# Altium schematic sheet BOOSTXL-AUDIO_Main.SchDoc
size 431 x 279 mm; Date: Not shown in title block; ApprovedBy: Not shown in title block; CheckedBy: Not shown in title block; Author: Not shown in title block; CompanyName: Not shown in title block; Engineer: Not shown in title block; Organization: Not shown in title block; Address1: Not shown in title block; Address2: Not shown in title block; Address3: Not shown in title block; Address4: Not shown in title block; DocumentNumber: 1; Revision: Use project parameter SCH_Rev; SheetNumber: 1; SheetTotal: 2; PageSetup: Record=PageOptions|CenterHorizontal=True|CenterVertical=True|PrintScale=0.62|XCorrection=1.00|YCorrection=1.00|PrintKind=0|BorderSize=5000000|LeftOffset=0|BottomOffset=0|Orientation=2|PaperLength=1000|PaperWidth=1000|Scale=100|PaperSource=15|PrintQuality=600|MediaType=1|DitherType=10|PrintScaleMode=1|PaperKind=Letter; CurrentTime: Not shown in title block; CurrentDate: Not shown in title block; Time: Not shown in title block; DocumentFullPathAndName: Not shown in title block; DocumentName: Not shown in title block; ModifiedDate: Not shown in title block; ImagePath: Not shown in title block
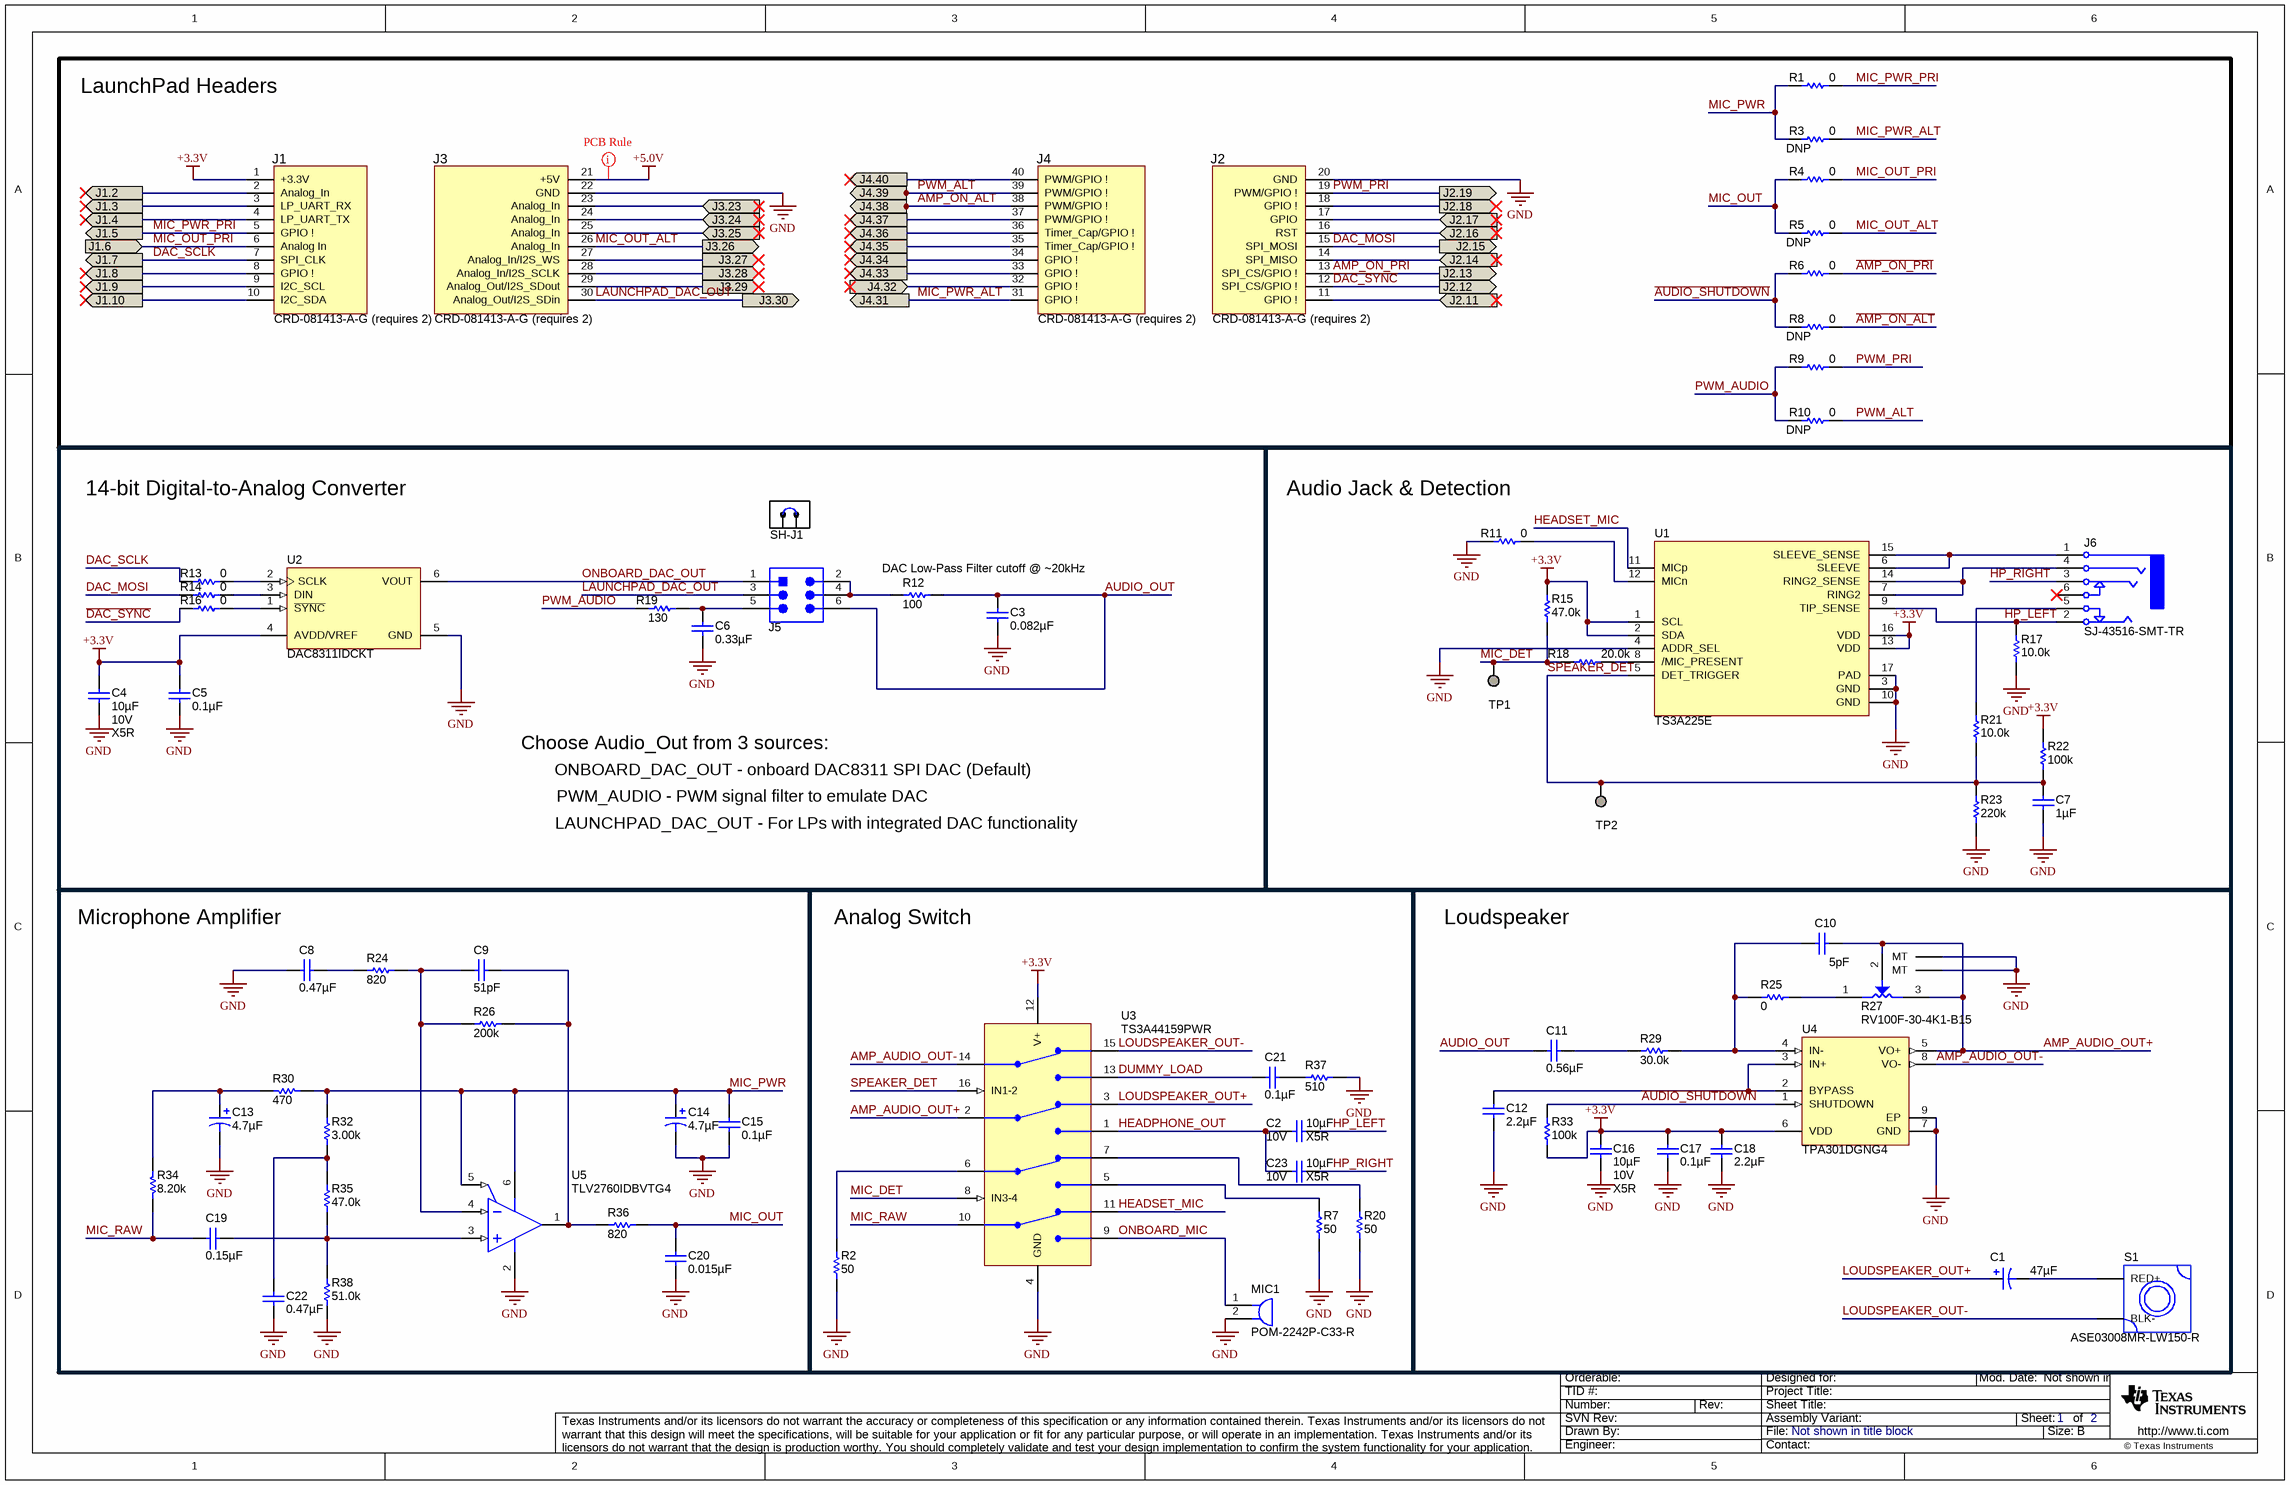
[diagram p0: BOOSTXL-AUDIO_Main.SchDoc]

## Parts
C1  ValueDisplayed: 47µF  [3528-21]  (hidden comment: TPSB476K010R0250)
C2  ValueDisplayed: 10µF  Value2: 10V  TempCo: X5R  [0603]  (hidden comment: C1608X5R1A106M)
C3  ValueDisplayed: 0.082µF  [0603]  (hidden comment: GRM188R71C823KA01D)
C4  ValueDisplayed: 10µF  Value2: 10V  TempCo: X5R  [0603]  (hidden comment: C1608X5R1A106M)
C5  ValueDisplayed: 0.1µF  [0603]  (hidden comment: GRM188R70J104KA01D)
C6  ValueDisplayed: 0.33µF  [0603]  (hidden comment: C0603C334K8RACTU)
C7  ValueDisplayed: 1µF  [0603]  (hidden comment: GRM188R71C105KA12D)
C8  ValueDisplayed: 0.47µF  [0603]  (hidden comment: GRM188R60J474KA01D)
C9  ValueDisplayed: 51pF  [0603]  (hidden comment: GRM1885C2A510JA01D)
C10  ValueDisplayed: 5pF  [0603]  (hidden comment: CC0603CRNPO9BN5R0)
C11  ValueDisplayed: 0.56µF  [0603]  (hidden comment: GRM188R71A564KA61D)
C12  ValueDisplayed: 2.2µF  [0603]  (hidden comment: GRM188R61A225KE34D)
C13  ValueDisplayed: 4.7µF  [3216-18]  (hidden comment: TPSA475K010R1400)
C14  ValueDisplayed: 4.7µF  [3216-18]  (hidden comment: TPSA475K010R1400)
C15  ValueDisplayed: 0.1µF  [0603]  (hidden comment: GRM188R70J104KA01D)
C16  ValueDisplayed: 10µF  Value2: 10V  TempCo: X5R  [0603]  (hidden comment: C1608X5R1A106M)
C17  ValueDisplayed: 0.1µF  [0603]  (hidden comment: GRM188R70J104KA01D)
C18  ValueDisplayed: 2.2µF  [0603]  (hidden comment: GRM188R61A225KE34D)
C19  ValueDisplayed: 0.15µF  [0603]  (hidden comment: GRM188R61A154KA01D)
C20  ValueDisplayed: 0.015µF  [0603]  (hidden comment: C0603C153K1RACTU)
C21  ValueDisplayed: 0.1µF  [0603]  (hidden comment: GRM188R70J104KA01D)
C22  ValueDisplayed: 0.47µF  [0603]  (hidden comment: GRM188R60J474KA01D)
C23  ValueDisplayed: 10µF  Value2: 10V  TempCo: X5R  [0603]  (hidden comment: C1608X5R1A106M)
J1  CRD-081413-A-G (requires 2)  [40Pin BP]  (parts A,B,C,D of 4)
J5  PBC03DAAN  [Sullins_PBC03DAAN]  (value not drawn)
J6  SJ-43516-SMT-TR  [CUI_SJ-43516-SMT]
MIC1  POM-2242P-C33-R  [MIC_POM-2242P-C33-R]
R1  ValueDisplayed: 0  [0603]  (hidden comment: CRCW06030000Z0EA)
R2  ValueDisplayed: 50  [0603]  (hidden comment: CRCW060350R0FKEA)
R3  ValueDisplayed: 0  [0603]  (hidden comment: CRCW06030000Z0EA)
R4  ValueDisplayed: 0  [0603]  (hidden comment: CRCW06030000Z0EA)
R5  ValueDisplayed: 0  [0603]  (hidden comment: CRCW06030000Z0EA)
R6  ValueDisplayed: 0  [0603]  (hidden comment: CRCW06030000Z0EA)
R7  ValueDisplayed: 50  [0603]  (hidden comment: CRCW060350R0FKEA)
R8  ValueDisplayed: 0  [0603]  (hidden comment: CRCW06030000Z0EA)
R9  ValueDisplayed: 0  [0603]  (hidden comment: CRCW06030000Z0EA)
R10  ValueDisplayed: 0  [0603]  (hidden comment: CRCW06030000Z0EA)
R11  ValueDisplayed: 0  [0603]  (hidden comment: CRCW06030000Z0EA)
R12  ValueDisplayed: 100  [0603]  (hidden comment: RC0603FR-07100RL)
R13  ValueDisplayed: 0  [0603]  (hidden comment: CRCW06030000Z0EA)
R14  ValueDisplayed: 0  [0603]  (hidden comment: CRCW06030000Z0EA)
R15  ValueDisplayed: 47.0k  [0603]  (hidden comment: RC0603FR-0747KL)
R16  ValueDisplayed: 0  [0603]  (hidden comment: CRCW06030000Z0EA)
R17  ValueDisplayed: 10.0k  [0603]  (hidden comment: RC0603FR-0710KL)
R18  ValueDisplayed: 20.0k  [0603]  (hidden comment: RC0603FR-0720KL)
R19  ValueDisplayed: 130  [0603]  (hidden comment: RC0603FR-07130RL)
R20  ValueDisplayed: 50  [0603]  (hidden comment: CRCW060350R0FKEA)
R21  ValueDisplayed: 10.0k  [0603]  (hidden comment: RC0603FR-0710KL)
R22  ValueDisplayed: 100k  [0603]  (hidden comment: CRCW0603100KFKEA)
R23  ValueDisplayed: 220k  [0603]  (hidden comment: RC0603FR-07220KL)
R24  value 820  [0603]  (hidden comment: RC0603FR-07820RL)
R25  ValueDisplayed: 0  [0603]  (hidden comment: CRCW06030000Z0EA)
R26  ValueDisplayed: 200k  [0603]  (hidden comment: RC0603FR-07200KL)
R27  RV100F-30-4K1-B15  [RV100F-30-4K1-B15]
R29  ValueDisplayed: 30.0k  [0603]  (hidden comment: RC0603FR-0730KL)
R30  value 470  [0603]  (hidden comment: RC0603FR-07470RL)
R32  ValueDisplayed: 3.00k  [0603]  (hidden comment: RC0603FR-073KL)
R33  ValueDisplayed: 100k  [0603]  (hidden comment: CRCW0603100KFKEA)
R34  value 8.20k  [0603]  (hidden comment: RC0603FR-078K2L)
R35  ValueDisplayed: 47.0k  [0603]  (hidden comment: RC0603FR-0747KL)
R36  value 820  [0603]  (hidden comment: RC0603FR-07820RL)
R37  ValueDisplayed: 510  [0603]  (hidden comment: RC0603FR-07510RL)
R38  ValueDisplayed: 51.0k  [0603]  (hidden comment: RC0603FR-0751KL)
S1  ASE03008MR-LW150-R  [ASE03008MR-LW150-R]
SH-J1  969102-0000-DA  [SNT-100-BK-G]  (value not drawn)
TP1  TESTPOINT  [TP_H045P075]  (value not drawn)  (no BOM)
TP2  TESTPOINT  [TP_H045P075]  (value not drawn)  (no BOM)
U1  TS3A225E  [QFN-16 (RTE)]
U2  DAC8311IDCKT  [TI-DCK6_V]
U3  TS3A44159PWR  [PW0016A_N]
U4  TPA301DGNG4  [TI-DGN8-1760X1425TP_M]
U5  TLV2760IDBVTG4  [DBV0006A_N]

## Blocks framed on the sheet
LaunchPad Headers: J1 R1 R3-R6 R8-R10
14-bit Digital-to-Analog Converter: C3-C6 J5 R12-R14 R16 R19 SH-J1 U2
Audio Jack & Detection: C7 J6 R11 R15 R17 R18 R21-R23 TP1 TP2 U1
Microphone Amplifier: C8 C9 C13-C15 C19 C20 C22 R24 R26 R30 R32 R34-R36 R38 U5
Analog Switch: C2 C21 C23 MIC1 R2 R7 R20 R37 U3
Loudspeaker: C1 C10-C12 C16-C18 R25 R27 R29 R33 S1 U4

## Ports
J1.2, J1.3, J1.4, J1.5 (out), J1.6 (in), J1.7 (out), J1.8, J1.9, J1.10, J2.11, J2.12 (out), J2.13 (out), J2.14, J2.15 (out), J2.16, J2.17, J2.18 (out), J2.19 (out), J3.23, J3.24, J3.25, J3.26 (out), J3.27 (out), J3.28 (out), J3.29 (out), J3.30 (out), J4.31 (out), J4.32 (in), J4.33, J4.34, J4.35, J4.36, J4.37, J4.38 (out), J4.39 (out), J4.40

## Nets
+3.3V: C4.1 C5.1 C16.2 C17.2 C18.1 J1.1(+3.3V) R15.1 R22.1 R33.1 U1.1(SCL) U1.2(SDA) U1.13(VDD) U1.16(VDD) U2.4(AVDD/VREF) U3.12(V+) U4.6(VDD)
+5.0V: J1.21(+5V)
GND: C3.1 C4.2 C5.2 C6.2 C7.1 C8.1 C12.2 C13.2(-) C14.2(-) C15.2 C16.1 C17.1 C18.2 C20.2 C22.1 J1.20(GND) J1.22(GND) MIC1.2 R2.2 R7.2 R11.1 R17.2 R20.2 R23.2 R27.GND(MT) R37.1 R38.1 U1.3(GND) U1.4(ADDR_SEL) U1.10(GND) U1.17(PAD) U2.5(GND) U3.4(GND) U4.7(GND) U4.9(EP) U5.2(GND)
~{AMP_ON_ALT}: J1.38(PWM/GPIO_!) R8.2 ; port J4.38
~{AMP_ON_PRI}: J1.13(SPI_CS/GPIO_!) R6.2 ; port J2.13
~{AUDIO_SHUTDOWN}: R6.1 R8.1 R33.2 U4.1(SHUTDOWN)
~{DAC_SYNC}: J1.12(SPI_CS/GPIO_!) R16.1 ; port J2.12
AMP_AUDIO_OUT+: C10.2 R27.2(A2) R27.3(A3) U3.2(COM2) U4.5(VO+)
AMP_AUDIO_OUT-: U3.14(COM1) U4.8(VO-)
AUDIO_OUT: C3.2 C11.2 J5.6 R12.2
DAC_MOSI: J1.15(SPI_MOSI) R14.1 ; port J2.15
DAC_SCLK: J1.7(SPI_CLK) R13.1 ; port J1.7
DUMMY_LOAD: C21.2 U3.13(NO1)
HEADPHONE_OUT: C2.1 C23.1 U3.1(NO2)
HEADSET_MIC: U1.11(MICp) U3.11(NC4)
HP_LEFT: C2.2 J6.2(TIP) R17.1 U1.9(TIP_SENSE)
HP_RIGHT: C23.2 J6.3(RING_1)
J1.2: J1.2(Analog_In) ; port J1.2
J1.3: J1.3(LP_UART_RX) ; port J1.3
J1.4: J1.4(LP_UART_TX) ; port J1.4
J1.8: J1.8(GPIO_!) ; port J1.8
J1.9: J1.9(I2C_SCL) ; port J1.9
J1.10: J1.10(I2C_SDA) ; port J1.10
J2.11: J1.11(GPIO_!) ; port J2.11
J2.14: J1.14(SPI_MISO) ; port J2.14
J2.16: J1.16(RST) ; port J2.16
J2.17: J1.17(GPIO) ; port J2.17
J2.18: J1.18(GPIO_!) ; port J2.18
J3.23: J1.23(Analog_In) ; port J3.23
J3.24: J1.24(Analog_In) ; port J3.24
J3.25: J1.25(Analog_In) ; port J3.25
J3.27: J1.27(Analog_In/I2S_WS) ; port J3.27
J3.28: J1.28(Analog_In/I2S_SCLK) ; port J3.28
J3.29: J1.29(Analog_Out/I2S_SDout) ; port J3.29
J4.32: J1.32(GPIO_!) ; port J4.32
J4.33: J1.33(GPIO_!) ; port J4.33
J4.34: J1.34(GPIO_!) ; port J4.34
J4.35: J1.35(Timer_Cap/GPIO_!) ; port J4.35
J4.36: J1.36(Timer_Cap/GPIO_!) ; port J4.36
J4.37: J1.37(PWM/GPIO_!) ; port J4.37
J4.40: J1.40(PWM/GPIO_!) ; port J4.40
LAUNCHPAD_DAC_OUT: J1.30(Analog_Out/I2S_SDin) J5.3 ; port J3.30
LOUDSPEAKER_OUT+: C1.1(+) U3.3(NC2)
LOUDSPEAKER_OUT-: S1.2(BLK-) U3.15(NC1)
MIC_DET: R15.2 R18.1 TP1.1 U3.8(IN3-4)
MIC_OUT: C20.1 R4.1 R5.1 R36.2
MIC_OUT_ALT: J1.26(Analog_In) R5.2 ; port J3.26
MIC_OUT_PRI: J1.6(Analog_In) R4.2 ; port J1.6
MIC_PWR: C14.1(+) C15.1 R1.1 R3.1 R30.1 R32.2 U5.5(~{SHDN}) U5.6(VDD)
MIC_PWR_ALT: J1.31(GPIO_!) R3.2 ; port J4.31
MIC_PWR_PRI: J1.5(GPIO_!) R1.2 ; port J1.5
MIC_RAW: C19.1 R34.1 U3.10(COM4)
ONBOARD_DAC_OUT: J5.1 U2.6(VOUT)
ONBOARD_MIC: MIC1.1 U3.9(NO4)
PWM_ALT: J1.39(PWM/GPIO_!) R10.2 ; port J4.39
PWM_AUDIO: R9.1 R10.1 R19.1
PWM_PRI: J1.19(PWM/GPIO_!) R9.2 ; port J2.19
SPEAKER_DET: C7.2 R21.2 R22.2 R23.1 TP2.1 U1.5(DET_TRIGGER) U3.16(IN1-2)
NetC1_2: C1.2(-) S1.1(RED+)
NetC6_1: C6.1 J5.5 R19.2
NetC8_2: C8.2 R24.2
NetC9_1: C9.1 R24.1 R26.1 U5.4(IN-)
NetC9_2: C9.2 R26.2 R36.1 U5.1(OUT)
NetC10_1: C10.1 R25.1 R29.2 U4.4(IN-)
NetC11_1: C11.1 R29.1
NetC12_1: C12.1 U4.2(BYPASS) U4.3(IN+)
NetC13_1: C13.1(+) R30.2 R34.2
NetC19_2: C19.2 R35.1 R38.2 U5.3(IN+)
NetC21_1: C21.1 R37.2
NetC22_2: C22.2 R32.1 R35.2
NetJ5_2: J5.2 J5.4 R12.1
NetJ6_1: J6.1(SLEEVE) U1.6(SLEEVE) U1.15(SLEEVE_SENSE)
NetJ6_4: J6.4(RING_2) U1.7(RING2) U1.14(RING2_SENSE)
NetJ6_5: J6.5(TIP_SWITCH) R21.1
NetR2_1: R2.1 U3.6(COM3)
NetR7_1: R7.1 U3.5(NO3)
NetR11_2: R11.2 U1.12(MICn)
NetR13_2: R13.2 U2.2(SCLK)
NetR14_2: R14.2 U2.3(DIN)
NetR16_2: R16.2 U2.1(~{SYNC})
NetR18_2: R18.2 U1.8(/MIC_PRESENT)
NetR20_1: R20.1 U3.7(NC3)
NetR25_2: R25.2 R27.1(A1)

Not connected (* = marked no-connect by the designer): J6 6(RING_SWITCH)*

## Layout directives
rule Width Constraint [Pref Width = 15mil    Min Width = 15mil    Max Width = 20mil]: +5.0V

## Notes on the sheet
- (near J1) J1
- J3
- (near J1) J4
- J2
- DAC Low-Pass Filter cutoff @ ~20kHz
- Choose Audio_Out from 3 sources:
- ONBOARD_DAC_OUT - onboard DAC8311 SPI DAC (Default)
- PWM_AUDIO - PWM signal filter to emulate DAC
- LAUNCHPAD_DAC_OUT - For LPs with integrated DAC functionality
- Drawn By:
- SVN Rev:
- Number:
- TID #:
- Orderable:
- Rev:
- Sheet Title:
- File:
- Project Title:
- Designed for:
- Assembly Variant:
- Mod. Date:
- Sheet:
- Size:
- of
- B
- http://www.ti.com
- Texas Instruments and/or its licensors do not warrant the accuracy or completeness of this specification or any information contained therein. Texas Instruments and/or its licensors do not warrant that this design will meet the specifications, will be suitable for your application or fit for any particular purpose, or will operate in an implementation. Texas Instruments and/or its licensors do not warrant that the design is production worthy. You should completely validate and test your design implementation to confirm the system functionality for your application.
- Engineer:
- Contact:
- © Texas Instruments

## Library data of the parts
C1 = TPSB476K010R0250: CAP, TA, 47 µF, 10 V, +/- 10%, 0.25 ohm, SMD; Manufacturer: AVX; Polarized: Y; CompType: Capacitor; Value: 47uF; U/M: EA; Cap_F: 0.000047; Tolerance_%: 10; Value2: 10V; ESR_ohm: 0.25; IRMS_A: 0.525; TaMin_C: -55; TaMax_C: 125; Cap_Case: B; SymbolVersion: 2008-07-09; PartNumber: TPSB476K010R0250; PackageReference: 3528-21; RoHS: Y; Value1: 0.25 ohm; VDC_V: 10; MountType: SMT; Technology: TA; Series: TPS; Publisher: Texas Instruments; LatestRevisionDate: 2015-03-19; LatestRevisionNote: Updated supplier links; ComponentLink1Description: Datasheet link; ComponentLink1URL: http://www.avx.com/docs/masterpubs/tantniob.pdf; Supplier 1: Digi-Key; Supplier Part Number 1: 478-3085-1-ND; Supplier 2: Mouser; Supplier Part Number 2: 581-TPSB476K010R0250; Supplier 3: Farnell; Supplier Part Number 3: 1702723
C2 C4 C16 C23 = C1608X5R1A106M: CAP, CERM, 10 µF, 10 V, +/- 20%, X5R, 0603; Manufacturer: TDK; Polarized: N; CompType: Capacitor; Value: 10uF; U/M: EA; Cap_F: 0.00001; Tolerance_%: 20; ESR_ohm: 0.0078; Value1: 0.0078 ohm; VDC_V: 10; IRMS_A: 1.85; TaMin_C: -55; TaMax_C: 85; SymbolVersion: 2008-07-09; PartNumber: C1608X5R1A106M; PackageReference: 0603; RoHS: Y; MountType: SMT; Technology: Ceramic; Cap_Case: 0603; Published: 2008-06-19; Publisher: Texas Instruments; LatestRevisionDate: 2014-09-22; ComponentLink1Description: Datasheet link; ComponentLink1URL: http://www.tdk.com/pdf/general_B11.pdf; Supplier 1: Digi-Key; Supplier Part Number 1: 445-6853-1-ND; Supplier 2: Farnell; Supplier Part Number 2: 1962113
C3 = GRM188R71C823KA01D: CAP, CERM, 0.082 µF, 16 V, +/- 10%, X7R, 0603; Manufacturer: MuRata; Polarized: N; CompType: Capacitor; Value: 0.082uF; U/M: EA; Cap_F: 0.000000082; Tolerance_%: 10; Value1: Unknown; VDC_V: 16; Value2: 16V; TaMin_C: -55; TaMax_C: 125; SymbolVersion: 2008-07-09; PartNumber: GRM188R71C823KA01D; PackageReference: 0603; RoHS: Y; MountType: SMT; Technology: Ceramic; TempCo: X7R; Cap_Case: 0603; Published: 2008-06-19; Publisher: Texas Instruments; LatestRevisionDate: 2015-04-13; ComponentLink1Description: Datasheet link; ComponentLink1URL: http://search.murata.co.jp/Ceramy/PnsearchViewAction.do?HnOFG=ON&HnNFG=ON&SEL_CNT=50&sLang=en&sKey=GRM188R71C823KA01D&x=9&y=9&search=startwith; Supplier 1: Mouser; Supplier Part Number 1: 81-GRM18R71C823KA01D
C5 C15 C17 C21 = GRM188R70J104KA01D: CAP, CERM, 0.1uF, 6.3V, +/-10%, X7R, 0603; Manufacturer: MuRata; Polarized: N; CompType: Capacitor; U/M: EA; Cap_F: 0.0000001; Tolerance_%: 10; Value1: Unknown; VDC_V: 6.3; TaMin_C: -55; TaMax_C: 125; SymbolVersion: 2008-07-09; Value: 0.1uF; PartNumber: GRM188R70J104KA01D; PackageReference: 0603; RoHS: Y; Value2: 6.3V; MountType: SMT; Technology: Ceramic; TempCo: X7R; Cap_Case: 0603; Published: 2008-06-19; Publisher: Texas Instruments; LatestRevisionDate: 2014-02-27; ComponentLink1Description: Datasheet link; ComponentLink1URL: http://search.murata.co.jp/Ceramy/PnsearchViewAction.do?HnOFG=ON&HnNFG=ON&SEL_CNT=50&sLang=en&sKey=GRM188R70J104KA01D&x=9&y=9&search=startwith; Supplier 1: Digi-Key; Supplier Part Number 1: GRM188R70J104KA01D-ND; Supplier 2: Mouser; Supplier Part Number 2: 81-GRM188R70J104KA1D
C6 = C0603C334K8RACTU: CAP, CERM, 0.33 µF, 10 V, +/- 10%, X7R, 0603; Manufacturer: Kemet; Polarized: N; CompType: Capacitor; Value: 0.33uF; U/M: EA; Cap_F: 0.00000033; Tolerance_%: 10; Value1: Unknown; Value2: 10V; TaMin_C: -55; TaMax_C: 125; SymbolVersion: 2008-07-09; PartNumber: C0603C334K8RACTU; PackageReference: 0603; RoHS: Y; VDC_V: 10; MountType: SMT; Technology: Ceramic; TempCo: X7R; Cap_Case: 0603; Published: 2008-06-19; Publisher: Texas Instruments; LatestRevisionDate: 2015-04-13; ComponentLink1Description: Datasheet link; ComponentLink1URL: http://www.kemet.com/kemet/web/homepage/kechome.nsf/vapubfiles/F3102_Y5V.pdf/$file/F3102_Y5V.pdf; Supplier 1: Digi-Key; Supplier Part Number 1: 399-4917-1-ND; Supplier 2: Mouser; Supplier Part Number 2: 80-C0603C334K8R
C7 = GRM188R71C105KA12D: CAP, CERM, 1 µF, 16 V, +/- 10%, X7R, 0603; Manufacturer: MuRata; Polarized: N; CompType: Capacitor; Value: 1uF; U/M: EA; Cap_F: 0.000001; Tolerance_%: 10; ESR_ohm: 0.011; Value1: 0.011 ohm; VDC_V: 16; Value2: 16V; TaMin_C: -55; TaMax_C: 125; SymbolVersion: 2008-07-09; PartNumber: GRM188R71C105KA12D; PackageReference: 0603; RoHS: Y; MountType: SMT; Technology: Ceramic; TempCo: X7R; Cap_Case: 0603; Published: 2008-06-19; Publisher: Texas Instruments; LatestRevisionDate: 2015-04-13; ComponentLink1Description: Datasheet link; ComponentLink1URL: http://search.murata.co.jp/Ceramy/PnsearchViewAction.do?HnOFG=ON&HnNFG=ON&SEL_CNT=50&sLang=en&sKey=GRM188R71C105KA12D&x=9&y=9&search=startwith; Supplier 1: Digi-Key; Supplier Part Number 1: 490-3900-1-ND; Supplier 2: Mouser; Supplier Part Number 2: 81-GRM188R71C105KA12; Supplier 3: Farnell; Supplier Part Number 3: 1828826
C8 C22 = GRM188R60J474KA01D: CAP, CERM, 0.47uF, 6.3V, +/-10%, X5R, 0603; Manufacturer: MuRata; Polarized: N; CompType: Capacitor; U/M: EA; Cap_F: 0.00000047; Tolerance_%: 10; Value1: Unknown; VDC_V: 6.3; TaMin_C: -55; TaMax_C: 85; SymbolVersion: 2008-07-09; Value: 0.47uF; PartNumber: GRM188R60J474KA01D; PackageReference: 0603; RoHS: Y; Value2: 6.3V; MountType: SMT; Technology: Ceramic; TempCo: X5R; Cap_Case: 0603; Published: 2008-06-19; Publisher: Texas Instruments; LatestRevisionDate: 2014-02-27; ComponentLink1Description: Datasheet link; ComponentLink1URL: http://search.murata.co.jp/Ceramy/PnsearchViewAction.do?HnOFG=ON&HnNFG=ON&SEL_CNT=50&sLang=en&sKey=GRM188R60J474KA01D&x=9&y=9&search=startwith; Supplier 1: Digi-Key; Supplier Part Number 1: 490-1548-1-ND; Supplier 2: Mouser; Supplier Part Number 2: 81-GRM188R60J474KA01
C9 = GRM1885C2A510JA01D: CAP, CERM, 51 pF, 100 V, +/- 5%, C0G/NP0, 0603; Manufacturer: MuRata; Polarized: N; CompType: Capacitor; Value: 51pF; U/M: EA; Cap_F: 0.000000000051; Tolerance_%: 5; Value1: Unknown; VDC_V: 100; Value2: 100V; TaMin_C: -55; TaMax_C: 125; SymbolVersion: 2008-07-09; PartNumber: GRM1885C2A510JA01D; PackageReference: 0603; RoHS: Y; MountType: SMT; Technology: Ceramic; TempCo: C0G/NP0; Cap_Case: 0603; Published: 2008-06-19; Publisher: Texas Instruments; LatestRevisionDate: 2015-04-13; ComponentLink1Description: Datasheet link; ComponentLink1URL: http://search.murata.co.jp/Ceramy/PnsearchViewAction.do?HnOFG=ON&HnNFG=ON&SEL_CNT=50&sLang=en&sKey=GRM1885C2A510JA01D&x=9&y=9&search=startwith; Supplier 1: Digi-Key; Supplier Part Number 1: 490-1344-1-ND; Supplier 2: Mouser; Supplier Part Number 2: 81-GRM1885C2A510JA1D
C10 = Capacitor: CAP, CERM, 5 pF, 50 V, +/- 5%, C0G/NP0, 0603; Manufacturer: Yageo America; Polarized: N; Value: 5pF; U/M: EA; Cap_F: 0.000000000005; TaMax_C: 125; TaMin_C: -55; Tolerance_%: 5; Value1: Unknown; Value2: 50V; VDC_V: 50; CompType: Capacitor; SymbolVersion: 2008-07-09; PackageReference: 0603; PartNumber: CC0603CRNPO9BN5R0; RoHS: Y; MountType: SMT; ComponentLink1Description: Datasheet Link; ComponentLink1URL: http://www.yageo.com/documents/recent/UPY-GP_NP0_16V-to-50V_10.pdf; Publisher: Texas Instruments; LatestRevisionDate: 2014-12-30; Cap_Case: 0603; Supplier 1: Digi-Key; Supplier 2: Mouser; Supplier Part Number 1: 311-1054-1-ND; Technology: Ceramic; TempCo: C0G/NP0
C11 = GRM188R71A564KA61D: CAP, CERM, 0.56 µF, 10 V, +/- 10%, X7R, 0603; Manufacturer: MuRata; Polarized: N; CompType: Capacitor; Value: 0.56uF; U/M: EA; Cap_F: 0.00000056; Tolerance_%: 10; Value1: Unknown; Value2: 10V; TaMin_C: -55; TaMax_C: 125; AEC Category: Q200; SymbolVersion: 2008-07-09; PartNumber: GRM188R71A564KA61D; PackageReference: 0603; RoHS: Y; VDC_V: 10; MountType: SMT; Technology: Ceramic; TempCo: X7R; Cap_Case: 0603; Published: 2008-06-19; Publisher: Texas Instruments; LatestRevisionDate: 2015-11-09; ComponentLink1Description: Datasheet link; ComponentLink1URL: http://search.murata.co.jp/Ceramy/PnsearchViewAction.do?HnOFG=ON&HnNFG=ON&SEL_CNT=50&sLang=en&sKey=GRM188R71A564KA61D&x=9&y=9&search=startwith; Supplier 1: Digi-Key; Supplier Part Number 1: GRM188R71A564KA61D-ND; Supplier 2: Mouser; Supplier Part Number 2: 81-GRM188R71A564KA1D; AEC Qualified: ?
C12 C18 = GRM188R61A225KE34D: CAP, CERM, 2.2 µF, 10 V, +/- 10%, X5R, 0603; Manufacturer: MuRata; Polarized: N; CompType: Capacitor; Value: 2.2uF; U/M: EA; Cap_F: 0.0000022; Tolerance_%: 10; Value1: Unknown; Value2: 10V; TaMin_C: -55; TaMax_C: 85; SymbolVersion: 2008-07-09; PartNumber: GRM188R61A225KE34D; PackageReference: 0603; RoHS: Y; VDC_V: 10; MountType: SMT; Technology: Ceramic; TempCo: X5R; Cap_Case: 0603; Published: 2008-06-19; Publisher: Texas Instruments; LatestRevisionDate: 2015-02-05; ComponentLink1Description: Datasheet link; ComponentLink1URL: http://search.murata.co.jp/Ceramy/PnsearchViewAction.do?HnOFG=ON&HnNFG=ON&SEL_CNT=50&sLang=en&sKey=GRM188R61A225KE34D&x=9&y=9&search=startwith; Supplier 1: Digi-Key; Supplier Part Number 1: 490-1545-1-ND; Supplier 2: Mouser; Supplier Part Number 2: 81-GRM188R61A225KE34; Supplier 3: Farnell; Supplier Part Number 3: 1828799
C13 C14 = TPSA475K010R1400: CAP, TA, 4.7 µF, 10 V, +/- 10%, 1.4 ohm, SMD; Manufacturer: AVX; Polarized: Y; CompType: Capacitor; Value: 4.7uF; U/M: EA; Cap_F: 0.0000047; Tolerance_%: 10; Value1: 1.4 ohm; Value2: 10V; ESR_ohm: 1.4; IRMS_A: 0.208; TaMin_C: -55; TaMax_C: 125; Cap_Case: A; SymbolVersion: 2008-07-09; PartNumber: TPSA475K010R1400; PackageReference: 3216-18; RoHS: Y; VDC_V: 10; MountType: SMT; Technology: TA; Series: TPS; Publisher: Texas Instruments; LatestRevisionDate: 2014-11-20; LatestRevisionNote: Updated supplier links; ComponentLink1Description: Datasheet link; ComponentLink1URL: http://www.avx.com/docs/masterpubs/tantniob.pdf; Supplier 1: Digi-Key; Supplier Part Number 1: 478-2391-1-ND; Supplier 2: Mouser; Supplier Part Number 2: 581-TPSA475K010R1400; Supplier 3: Farnell; Supplier Part Number 3: 1135104
C19 = GRM188R61A154KA01D: CAP, CERM, 0.15uF, 10V, +/-10%, X5R, 0603; Manufacturer: MuRata; Polarized: N; CompType: Capacitor; U/M: EA; Cap_F: 0.00000015; Tolerance_%: 10; Value1: Unknown; TaMin_C: -55; TaMax_C: 85; SymbolVersion: 2008-07-09; Value: 0.15uF; PartNumber: GRM188R61A154KA01D; PackageReference: 0603; RoHS: Y; VDC_V: 10; Value2: 10V; MountType: SMT; Technology: Ceramic; TempCo: X5R; Cap_Case: 0603; Published: 2008-06-19; Publisher: Texas Instruments; LatestRevisionDate: 2014-02-27; ComponentLink1Description: Datasheet link; ComponentLink1URL: http://search.murata.co.jp/Ceramy/PnsearchViewAction.do?HnOFG=ON&HnNFG=ON&SEL_CNT=50&sLang=en&sKey=GRM188R61A154KA01D&x=9&y=9&search=startwith; Supplier 1: Digi-Key; Supplier Part Number 1: GRM188R61A154KA01D-ND; Supplier 2: Mouser; Supplier Part Number 2: 81-GRM188R61A154KA1D
C20 = C0603C153K1RACTU: CAP, CERM, 0.015 µF, 100 V, +/- 10%, X7R, 0603; Manufacturer: Kemet; Polarized: N; CompType: Capacitor; Value: 0.015uF; U/M: EA; Cap_F: 0.000000015; Tolerance_%: 10; Value1: Unknown; VDC_V: 100; Value2: 100V; TaMin_C: -55; TaMax_C: 125; SymbolVersion: 2008-07-09; PartNumber: C0603C153K1RACTU; PackageReference: 0603; RoHS: Y; MountType: SMT; Technology: Ceramic; TempCo: X7R; Cap_Case: 0603; Published: 2008-06-19; Publisher: Texas Instruments; LatestRevisionDate: 2014-11-24; ComponentLink1Description: Datasheet link; ComponentLink1URL: http://www.kemet.com/kemet/web/homepage/kechome.nsf/vapubfiles/F3102_Y5V.pdf/$file/F3102_Y5V.pdf; Supplier 1: Digi-Key; Supplier Part Number 1: 399-3474-1-ND; Supplier 2: Mouser; Supplier Part Number 2: 80-C0603C153K1R; Supplier 3: Farnell; Supplier Part Number 3: 1865546
J1 = 40Pin Booster Pack Connection: Manufacturer: MLE; SymbolCreator: a0272566; CompType: Long Lead Header; U/M: EA, IN, or GM; SymbolVersion: 2014-07-21; MountType: TH; RoHS: y; PartNumber: CRD-081413-A-G (requires 2); PackageReference: 100mil Header; ComponentLink1Description: http://www.retrodesignlab.com/LaunchPad/store/#!/CRD-081413-A-G/p/29462027/category=6922288; Alternate PartNumber: -; Alternate Manufacturer: -; Quantity: 2
J5 = PBC03DAAN: Header, 100mil, 3x2, Gold, TH; Manufacturer: Sullins Connector Solutions; SymbolCreator: a0412235; U/M: EA; SymbolVersion: 2013-10-14; PartNumber: PBC03DAAN; PackageReference: Sullins 100mil, 2x3, 230 mil above insulator; ClassName: Header; CompType: Header; RoHS: Y; MountType: TH; ComponentLink1Description: Datasheet Link; ComponentLink1URL: http://www.sullinscorp.com/catalogs/97_Page78-79_HEADER_.100_2.54mm_MALE_BREAKAWAY.pdf; Publisher: Texas Instruments; LatestRevisionDate: 2015-04-13; Supplier 1: Digi-Key; Supplier Part Number 1: S2011E-03-ND
J6 = SJ-43516-SMT-TR: AUDIO JACK 3.5mm 4COND, SMT; Manufacturer: CUI Inc.; SymbolCreator: Altium; U/M: EA; SymbolVersion: 2015-03-06; PartNumber: SJ-43516-SMT-TR; PackageReference: AUDIO JACK 3.5mm 4COND, SMT; CompType: AUDIO JACK; RoHS: Y; MountType: SMT; ComponentLink1Description: Datasheet Link; ComponentLink1URL: http://www.cui.com/product/resource/sj-4351x-smt-series.pdf; Publisher: Texas Instruments; LatestRevisionDate: 2015-11-10; Supplier 1: Digi-Key; Supplier Part Number 1: CP-43516SJCT-ND; Supplier 2: Mouser; Supplier Part Number 2: 490-SJ-43516-SMT-TR
MIC1 = POM-2242P-C33-R: Microphone, Condenser, Analog, Omnidirectional, -42DB, TH; Manufacturer: PUI Audio; SymbolCreator: a0412235; SymbolVersion: 2012-10-26; PartNumber: POM-2242P-C33-R; MountType: TH; ComponentLink1Description: Datasheet URL; ComponentLink1URL: http://www.puiaudio.com/pdf/POM-2242P-C33-R.pdf; RoHS: Y; PackageReference: 6mm DIA; Publisher: Texas Instruments; LatestRevisionDate: 2014-02-25; Supplier 1: Digi-Key; Supplier Part Number 1: 668-1149-ND; Supplier 2: Mouser; Supplier Part Number 2: 665-POM2242PC33R
R1 R3-R6 R8-R11 R13 R14 R16 R25 = CRCW06030000Z0EA: RES, 0, 5%, 0.1 W, 0603; Manufacturer: Vishay-Dale; CompType: Resistor; Value: 0; Value_Code: 0000; Tolerance_%: 5; Power_W: 0.1; Value2: 0.1W; VDC_V: 75; TempCo: 200 ppm/C; EIA_Code: E24; U/M: EA; SymbolVersion: 2009-05-29; PartNumber: CRCW06030000Z0EA; PackageReference: 0603; RoHS: Y; Res_ohm: 0; Value1: 5%; MountType: SMT; Technology: Thick Film; Published: 2008-06-26; Publisher: Texas Instruments; LatestRevisionDate: 2015-04-06; ComponentLink1Description: Datasheet link; ComponentLink1URL: http://www.vishay.com/docs/20035/dcrcwe3.pdf; Supplier 1: Digi-Key; Supplier Part Number 1: 541-0.0GCT-ND; Supplier 2: Mouser; Supplier Part Number 2: 71-CRCW0603-0-E3; Supplier 3: Farnell; Supplier Part Number 3: 1469739
  R3 R5 R8 R10: DNP: DNP
R2 R7 R20 = CRCW060350R0FKEA: RES, 50, 1%, 0.1 W, 0603; Manufacturer: Vishay-Dale; CompType: Resistor; Value: 50; Value_Code: 50R0; Tolerance_%: 1; Power_W: 0.1; Value2: 0.1W; VDC_V: 75; TempCo: 100 ppm/C; U/M: EA; SymbolVersion: 2009-05-29; PartNumber: CRCW060350R0FKEA; PackageReference: 0603; RoHS: Y; Res_ohm: 50; Value1: 1%; MountType: SMT; Technology: Thick Film; Published: 2008-06-26; Publisher: Texas Instruments; LatestRevisionDate: 2015-04-06; ComponentLink1Description: Datasheet link; ComponentLink1URL: http://www.vishay.com/docs/20035/dcrcwe3.pdf; Supplier 1: Mouser; Supplier Part Number 1: 71-CRCW0603-50-E3; Supplier 2: Farnell; Supplier Part Number 2: 2112878; Supplier 3: Newark; Supplier Part Number 3: 89M6778
R12 = RC0603FR-07100RL: RES, 100, 1%, 0.1 W, 0603; Manufacturer: Yageo America; CompType: Resistor; Value: 100; Value_Code: 100R; Tolerance_%: 1; Power_W: 0.1; Value2: 0.1W; VDC_V: 150; TempCo: 200 ppm/C; EIA_Code: E96; U/M: EA; SymbolVersion: 2009-05-29; PartNumber: RC0603FR-07100RL; PackageReference: 0603; RoHS: Y; Res_ohm: 100; Value1: 1%; MountType: SMT; Technology: Thick Film; Published: 2008-06-26; Publisher: Texas Instruments; LatestRevisionDate: 2015-04-06; ComponentLink1Description: Datasheet link; ComponentLink1URL: http://www.yageo.com/pdf/Pu-RC0603_51_PbFree_L_2.pdf; Supplier 1: Digi-Key; Supplier Part Number 1: 311-100HRCT-ND; Supplier 2: Mouser; Supplier Part Number 2: 603-RC0603FR-07100RL; Supplier 3: Farnell; Supplier Part Number 3: 9238360
R15 R35 = RC0603FR-0747KL: RES, 47.0 k, 1%, 0.1 W, 0603; Manufacturer: Yageo America; CompType: Resistor; Value: 47.0k; Res_ohm: 47000; Value_Code: 47k0; Tolerance_%: 1; Power_W: 0.1; Value2: 0.1W; VDC_V: 150; TempCo: 200 ppm/C; U/M: EA; SymbolVersion: 2009-05-29; PartNumber: RC0603FR-0747KL; PackageReference: 0603; RoHS: Y; Value1: 1%; MountType: SMT; Technology: Thick Film; Published: 2008-06-26; Publisher: Texas Instruments; ComponentLink1Description: Datasheet link; ComponentLink1URL: http://www.yageo.com/pdf/Pu-RC0603_51_PbFree_L_2.pdf; Supplier 1: Digi-Key; Supplier Part Number 1: 311-47.0KHRCT-ND; Supplier 2: Mouser; Supplier Part Number 2: 603-RC0603FR-0747KL; Supplier 3: Farnell; Supplier Part Number 3: 9238689
  R15: LatestRevisionDate: 2015-04-06
  R35: LatestRevisionDate: 2014-10-21
R17 R21 = RC0603FR-0710KL: RES, 10.0 k, 1%, 0.1 W, 0603; Manufacturer: Yageo America; CompType: Resistor; Value: 10.0k; Res_ohm: 10000; Value_Code: 10k0; Tolerance_%: 1; Power_W: 0.1; Value2: 0.1W; VDC_V: 150; TempCo: 200 ppm/C; EIA_Code: E96; U/M: EA; SymbolVersion: 2009-05-29; PartNumber: RC0603FR-0710KL; PackageReference: 0603; RoHS: Y; Value1: 1%; MountType: SMT; Technology: Thick Film; Published: 2008-06-26; Publisher: Texas Instruments; LatestRevisionDate: 2015-04-06; ComponentLink1Description: Datasheet link; ComponentLink1URL: http://www.yageo.com/pdf/Pu-RC0603_51_PbFree_L_2.pdf; Supplier 1: Digi-Key; Supplier Part Number 1: 311-10.0KHRCT-ND; Supplier 2: Mouser; Supplier Part Number 2: 603-RC0603FR-0710KL; Supplier 3: Farnell; Supplier Part Number 3: 9238603
R18 = RC0603FR-0720KL: RES, 20.0 k, 1%, 0.1 W, 0603; Manufacturer: Yageo America; CompType: Resistor; Value: 20.0k; Res_ohm: 20000; Value_Code: 20k0; Tolerance_%: 1; Power_W: 0.1; Value2: 0.1W; VDC_V: 150; TempCo: 200 ppm/C; EIA_Code: E96; U/M: EA; SymbolVersion: 2009-05-29; PartNumber: RC0603FR-0720KL; PackageReference: 0603; RoHS: Y; Value1: 1%; MountType: SMT; Technology: Thick Film; Published: 2008-06-26; Publisher: Texas Instruments; LatestRevisionDate: 2015-04-06; ComponentLink1Description: Datasheet link; ComponentLink1URL: http://www.yageo.com/pdf/Pu-RC0603_51_PbFree_L_2.pdf; Supplier 1: Digi-Key; Supplier Part Number 1: 311-20.0KHRCT-ND; Supplier 2: Mouser; Supplier Part Number 2: 603-RC0603FR-0720KL; Supplier 3: Farnell; Supplier Part Number 3: 1799331
R19 = RC0603FR-07130RL: RES, 130, 1%, 0.1 W, 0603; Manufacturer: Yageo America; CompType: Resistor; Value: 130; Value_Code: 130R; Tolerance_%: 1; Power_W: 0.1; Value2: 0.1W; VDC_V: 150; TempCo: 200 ppm/C; EIA_Code: E96; U/M: EA; SymbolVersion: 2009-05-29; PartNumber: RC0603FR-07130RL; PackageReference: 0603; RoHS: Y; Res_ohm: 130; Value1: 1%; MountType: SMT; Technology: Thick Film; Published: 2008-06-26; Publisher: Texas Instruments; LatestRevisionDate: 2015-04-06; ComponentLink1Description: Datasheet link; ComponentLink1URL: http://www.yageo.com/pdf/Pu-RC0603_51_PbFree_L_2.pdf; Supplier 1: Digi-Key; Supplier Part Number 1: 311-130HRCT-ND; Supplier 2: Mouser; Supplier Part Number 2: 603-RC0603FR-07130RL; Supplier 3: Farnell; Supplier Part Number 3: 1799326
R22 R33 = CRCW0603100KFKEA: RES, 100 k, 1%, 0.1 W, 0603; Manufacturer: Vishay-Dale; CompType: Resistor; Value: 100k; Res_ohm: 100000; Tolerance_%: 1; Power_W: 0.1; Value2: 0.1W; VDC_V: 75; TempCo: 100 ppm/C; EIA_Code: E96; U/M: EA; SymbolVersion: 2009-05-29; PartNumber: CRCW0603100KFKEA; PackageReference: 0603; RoHS: Y; Value_Code: 100k; Value1: 1%; MountType: SMT; Technology: Thick Film; Published: 2008-06-26; Publisher: Texas Instruments; ComponentLink1Description: Datasheet link; ComponentLink1URL: http://www.vishay.com/docs/20035/dcrcwe3.pdf; Supplier 1: Digi-Key; Supplier Part Number 1: 541-100KHCT-ND; Supplier 2: Mouser; Supplier Part Number 2: 71-CRCW0603-100K-E3; Supplier 3: Farnell; Supplier Part Number 3: 1469649
  R22: LatestRevisionDate: 2015-04-06
  R33: LatestRevisionDate: 2014-12-16
R23 = RC0603FR-07220KL: RES, 220 k, 1%, 0.1 W, 0603; Manufacturer: Yageo America; CompType: Resistor; Value: 220k; Res_ohm: 220000; Tolerance_%: 1; Power_W: 0.1; Value2: 0.1W; VDC_V: 150; TempCo: 200 ppm/C; U/M: EA; SymbolVersion: 2009-05-29; PartNumber: RC0603FR-07220KL; PackageReference: 0603; RoHS: Y; Value_Code: 220k; Value1: 1%; MountType: SMT; Technology: Thick Film; Published: 2008-06-26; Publisher: Texas Instruments; LatestRevisionDate: 2015-04-06; ComponentLink1Description: Datasheet link; ComponentLink1URL: http://www.yageo.com/pdf/Pu-RC0603_51_PbFree_L_2.pdf; Supplier 1: Digi-Key; Supplier Part Number 1: 311-220KHRCT-ND; Supplier 2: Mouser; Supplier Part Number 2: 603-RC0603FR-07220KL; Supplier 3: Farnell; Supplier Part Number 3: 9238760
R24 R36 = RC0603FR-07820RL: RES, 820 ohm, 1%, 0.1W, 0603; Manufacturer: Yageo America; CompType: Resistor; Value_Code: 820R; Tolerance_%: 1; Power_W: 0.1; VDC_V: 150; TempCo: 200 ppm/C; U/M: EA; SymbolVersion: 2009-05-29; PartNumber: RC0603FR-07820RL; PackageReference: 0603; RoHS: Y; Res_ohm: 820; Value1: 1%; Value2: 0.1W; MountType: SMT; Technology: Thick Film; Published: 2008-06-26; Publisher: Texas Instruments; LatestRevisionDate: 2014-01-08; ComponentLink1Description: Datasheet link; ComponentLink1URL: http://www.yageo.com/pdf/Pu-RC0603_51_PbFree_L_2.pdf; Supplier 1: Digi-Key; Supplier Part Number 1: 311-820HRCT-ND; Supplier 2: Mouser; Supplier Part Number 2: 603-RC0603FR-07820RL; Supplier 3: Farnell; Supplier Part Number 3: 9238476
R26 = RC0603FR-07200KL: RES, 200 k, 1%, 0.1 W, 0603; Manufacturer: Yageo America; CompType: Resistor; Value: 200k; Res_ohm: 200000; Tolerance_%: 1; Power_W: 0.1; Value2: 0.1W; VDC_V: 150; TempCo: 200 ppm/C; EIA_Code: E96; U/M: EA; SymbolVersion: 2009-05-29; PartNumber: RC0603FR-07200KL; PackageReference: 0603; RoHS: Y; Value_Code: 200k; Value1: 1%; MountType: SMT; Technology: Thick Film; Published: 2008-06-26; Publisher: Texas Instruments; LatestRevisionDate: 2015-04-06; ComponentLink1Description: Datasheet link; ComponentLink1URL: http://www.yageo.com/pdf/Pu-RC0603_51_PbFree_L_2.pdf; Supplier 1: Digi-Key; Supplier Part Number 1: 311-200KHRCT-ND; Supplier 2: Mouser; Supplier Part Number 2: 603-RC0603FR-07200KL; Supplier 3: Farnell; Supplier Part Number 3: 1799334
R27 = RV100F-30-4K1-B15: Potentiometers 10mm Linear 100K PC Mount; Manufacturer: Alpha (Taiwan); Alternate Manufacturer: Any; Alternate PartNumber: Equivalent; CompType: Pot; U/M: EA; PartNumber: RV100F-30-4K1-B15; RoHS: Y; PackageReference: SMT Slide switch; MountType: SMT; ComponentLink1Description: Datasheet Link; ComponentLink1URL: http://www.taiwanalpha.com.tw/english2014/p_e_013.htm; Value: 100k; Publisher: Texas Instruments; LatestRevisionDate: 2012-12-08; LatestRevisionNote: Changed publisher; Supplier 1: Digi-Key; Supplier 2: Mouser; Supplier Part Number 2: 312-1001F-100K
R29 = RC0603FR-0730KL: RES, 30.0 k, 1%, 0.1 W, 0603; Manufacturer: Yageo America; CompType: Resistor; Value: 30.0k; Res_ohm: 30000; Value_Code: 30k0; Tolerance_%: 1; Power_W: 0.1; Value2: 0.1W; VDC_V: 150; TempCo: 200 ppm/C; U/M: EA; AEC Category: Q200; SymbolVersion: 2009-05-29; PartNumber: RC0603FR-0730KL; PackageReference: 0603; RoHS: Y; Value1: 1%; MountType: SMT; Technology: Thick Film; Published: 2008-06-26; Publisher: Texas Instruments; LatestRevisionDate: 2015-10-21; ComponentLink1Description: Datasheet link; ComponentLink1URL: http://www.yageo.com/pdf/Pu-RC0603_51_PbFree_L_2.pdf; Supplier 1: Digi-Key; Supplier Part Number 1: 311-30.0KHRCT-ND; Supplier 2: Mouser; Supplier Part Number 2: 603-RC0603FR-0730KL; Supplier 3: Farnell; Supplier Part Number 3: 1799339; AEC Qualified: ?
R30 = RC0603FR-07470RL: RES, 470 ohm, 1%, 0.1W, 0603; Manufacturer: Yageo America; CompType: Resistor; Value_Code: 470R; Tolerance_%: 1; Power_W: 0.1; VDC_V: 150; TempCo: 200 ppm/C; U/M: EA; SymbolVersion: 2009-05-29; PartNumber: RC0603FR-07470RL; PackageReference: 0603; RoHS: Y; Res_ohm: 470; Value1: 1%; Value2: 0.1W; MountType: SMT; Technology: Thick Film; Published: 2008-06-26; Publisher: Texas Instruments; LatestRevisionDate: 2014-01-08; ComponentLink1Description: Datasheet link; ComponentLink1URL: http://www.yageo.com/pdf/Pu-RC0603_51_PbFree_L_2.pdf; Supplier 1: Digi-Key; Supplier Part Number 1: 311-470HRCT-ND; Supplier 2: Mouser; Supplier Part Number 2: 603-RC0603FR-07470RL; Supplier 3: Farnell; Supplier Part Number 3: 9238441
R32 = RC0603FR-073KL: RES, 3.00 k, 1%, 0.1 W, 0603; Manufacturer: Yageo America; CompType: Resistor; Value: 3.00k; Res_ohm: 3000; Value_Code: 3k00; Tolerance_%: 1; Power_W: 0.1; Value2: 0.1W; VDC_V: 150; TempCo: 200 ppm/C; U/M: EA; SymbolVersion: 2009-05-29; PartNumber: RC0603FR-073KL; PackageReference: 0603; RoHS: Y; Value1: 1%; MountType: SMT; Technology: Thick Film; Published: 2008-06-26; Publisher: Texas Instruments; LatestRevisionDate: 2014-10-21; ComponentLink1Description: Datasheet link; ComponentLink1URL: http://www.yageo.com/pdf/Pu-RC0603_51_PbFree_L_2.pdf; Supplier 1: Digi-Key; Supplier Part Number 1: 311-3.00KHRCT-ND; Supplier 2: Mouser; Supplier Part Number 2: 603-RC0603FR-073KL; Supplier 3: Farnell; Supplier Part Number 3: 1799337
R34 = RC0603FR-078K2L: RES, 8.20k ohm, 1%, 0.1W, 0603; Manufacturer: Yageo America; CompType: Resistor; Res_ohm: 8200; Value_Code: 8k20; Tolerance_%: 1; Power_W: 0.1; VDC_V: 150; TempCo: 200 ppm/C; U/M: EA; SymbolVersion: 2009-05-29; PartNumber: RC0603FR-078K2L; PackageReference: 0603; RoHS: Y; Value1: 1%; Value2: 0.1W; MountType: SMT; Technology: Thick Film; Published: 2008-06-26; Publisher: Texas Instruments; LatestRevisionDate: 2014-01-08; ComponentLink1Description: Datasheet link; ComponentLink1URL: http://www.yageo.com/pdf/Pu-RC0603_51_PbFree_L_2.pdf; Supplier 1: Digi-Key; Supplier Part Number 1: 311-8.20KHRCT-ND; Supplier 2: Mouser; Supplier Part Number 2: 603-RC0603FR-078K2L; Supplier 3: Farnell; Supplier Part Number 3: 9238590
R37 = RC0603FR-07510RL: RES, 510, 1%, 0.1 W, 0603; Manufacturer: Yageo America; CompType: Resistor; Value: 510; Value_Code: 510R; Tolerance_%: 1; Power_W: 0.1; Value2: 0.1W; VDC_V: 150; TempCo: 200 ppm/C; U/M: EA; SymbolVersion: 2009-05-29; PartNumber: RC0603FR-07510RL; PackageReference: 0603; RoHS: Y; Res_ohm: 510; Value1: 1%; MountType: SMT; Technology: Thick Film; Published: 2008-06-26; Publisher: Texas Instruments; LatestRevisionDate: 2015-04-06; ComponentLink1Description: Datasheet link; ComponentLink1URL: http://www.yageo.com/pdf/Pu-RC0603_51_PbFree_L_2.pdf; Supplier 1: Digi-Key; Supplier Part Number 1: 311-510HRCT-ND; Supplier 2: Mouser; Supplier Part Number 2: 603-RC0603FR-07510RL; Supplier 3: Farnell; Supplier Part Number 3: 1799351
R38 = RC0603FR-0751KL: RES, 51.0 k, 1%, 0.1 W, 0603; Manufacturer: Yageo America; CompType: Resistor; Value: 51.0k; Res_ohm: 51000; Value_Code: 51k0; Tolerance_%: 1; Power_W: 0.1; Value2: 0.1W; VDC_V: 150; TempCo: 200 ppm/C; U/M: EA; SymbolVersion: 2009-05-29; PartNumber: RC0603FR-0751KL; PackageReference: 0603; RoHS: Y; Value1: 1%; MountType: SMT; Technology: Thick Film; Published: 2008-06-26; Publisher: Texas Instruments; LatestRevisionDate: 2014-10-21; ComponentLink1Description: Datasheet link; ComponentLink1URL: http://www.yageo.com/pdf/Pu-RC0603_51_PbFree_L_2.pdf; Supplier 1: Digi-Key; Supplier Part Number 1: 311-51.0KHRCT-ND; Supplier 2: Mouser; Supplier Part Number 2: 603-RC0603FR-0751KL; Supplier 3: Farnell; Supplier Part Number 3: 1799349
S1 = PUI Speaker Enclosure: PUI SPEAKER ENCLOSURE 1 W 8 OHM 83 D; Manufacturer: PUI Audio; SymbolVersion: use current date i.e. 2008-05-20; SymbolCreator: a0866890; CompType: Header; U/M: EA; MountType: TH; RoHS: Y; PartNumber: ASE03008MR-LW150-R; PackageReference: Y; ComponentLink1Description: Datasheet Link; ComponentLink1URL: http://www.puiaudio.com/pdf/ASE03008MR-LW150-R.pdf; Alternate PartNumber: -; Alternate Manufacturer: -; LatestRevisionDate: 2013-03-20; LatestRevisionNote: Changed publisher; Publisher: Texas Instruments; Supplier 1: Digi-Key; Supplier 2: Mouser; Supplier Part Number 1: 668-1432-ND; Supplier Part Number 2: 665-ASE03008MRLW150R
SH-J1 = 969102-0000-DA: Shunt, 100mil, Gold plated, Black; Manufacturer: 3M; Alternate Manufacturer: Samtec; Value: 1x2; Note: You can "mate" this to a header by matching the designator.  i.e. use SH-J3 for header J3; ClassName: Shunt; CompType: Shunt; PartNumber: 969102-0000-DA; RoHS: Y; PackageReference: Shunt; MountType: N/A; ComponentLink1Description: Datasheet Link; ComponentLink1URL: http://multimedia.3m.com/mws/mediawebserver?66666UuZjcFSLXTtNxTElXf6EVuQEcuZgVs6EVs6E666666--; Publisher: Texas Instruments; LatestRevisionDate: 2015-04-14; Alternate PartNumber: SNT-100-BK-G; Supplier 1: Digi-Key; Supplier Part Number 1: 3M9580-ND; Supplier 2: Mouser; Supplier Part Number 2: 517-9691020000DA
TP1 TP2 = TP_H0.45P0.75: Manufacturer: Texas Instruments; CompType: Pad; SymbolVersion: 2010-10-20; PartNumber: TP_H0.45P0.75; PackageReference: Test Point, 0.45mm hole size; MountType: TH; ComponentLink1Description: Datasheet Link; ComponentLink1URL: https://sps06.itg.ti.com/sites/KMS/crossdivteams/altium/docs/ComponentDatasheets/testpin with 750um Padsice and 450um drillhole.pdf; Publisher: Texas Instruments; LatestRevisionDate: 2015-04-14
U1 = TS3A225E: Autonomous Audio Switch with Headset Type Detection; Manufacturer: Texas Instruments; SymbolVersion: use current date i.e. 2008-05-20; SymbolCreator: Use LDAP id; CompType: Used in some BOM reports.  Useful for finding later.; U/M: EA, IN, or GM; MountType: SMT; RoHS: Y; PartNumber: TS3A225E; PackageReference: RTE16; ComponentLink1Description: Datasheet Link; Alternate PartNumber: -; Alternate Manufacturer: -; Supplier 1: Digi-Key; Supplier Part Number 1: 296-30111-1-ND
U2 = CMP-0004-00352-1: 14-Bit, Single Channel, 80 uA, 1.8 to 5.5 V DAC, -40 to 125 degC, 6-pin SOT23 (DCK6), Green (RoHS & no Sb/Br); Manufacturer: Texas Instruments; Settling Time(us): 6; Interface: Serial SPI; INL(Max)(+/-LSB): 4; SNR(dB): 88; Resolution(Bits): 14; Power Consumption(Typ)(mW): 0.14; DNL(Max)(+/-LSB): 1; SubFamily: Precision DAC (=<10MSPS); SFDR(dB): 66; Mounting Technology: Surface Mount; ComponentLink1Description: Manufacturer URL; PackageReference: DCK6; ComponentLink2Description: Datasheet; ComponentLink3URL: http://www.ti.com/litv/pdf/mpds114c; ComponentLink1URL: http://www.ti.com/; DatasheetVersion: SBAS439B; PartNumber: DAC8311IDCKT; PackageVersion: 4093553-4/G, 01/2007; Eco-Plan: Green (RoHS & no Sb/Br); DAC Channels: 1; Code_JEDEC: MO-203; PackageDescription: 6-Pin Plastic Small Outline, Body 2 x 1.25 mm, Pitch 0.65 mm; ComponentLink3Description: Package Specification; ComponentLink2URL: http://www.ti.com/general/docs/lit/getliterature.tsp?genericPartNumber=DAC8311&fileType=pdf; MountType: SMT; Supplier 1: Digi-Key; Supplier Part Number 1: 296-23760-1-ND
U3 = TS3A44159PWR: 0.45 ohm QUAD SPDT ANALOG SWITCH QUAD-CHANNEL 2:1 MULTIPLEXER/DEMULTIPLEXER WITH TWO CONTROLS, PW0016A; Manufacturer: Texas Instruments; SymbolCreator: a0411947; CompType: IC; U/M: EA; SymbolVersion: 2013-01-29; PartNumber: TS3A44159PWR; PackageReference: PW0016A; MountType: SMT; ComponentLink1Description: Datasheet Link; ComponentLink1URL: http://www.ti.com/lit/gpn/ts3a44159; RoHS: Y; Publisher: Texas Instruments; LatestRevisionDate: 2015-04-13; Alternate Manufacturer: Texas Instruments
U4 = CMP-0991-00051-1: 350-mW Mono Class-AB Audio Amplifier, -40 to 85 degC, 8-pin SOP (DGN8), Green (RoHS & no Sb/Br); Manufacturer: Texas Instruments; Supply Min(Min)(Volt): 2.5; PSRR(dB): 78; Supply Max(Max)(Volt): 5.5; Output Power(W): 0.35; SubFamily: Dynamic Speaker; Eco-Plan: Green (RoHS & no Sb/Br); PackageReference: DGN8-1760X1425TP; ComponentLink3URL: http://www.ti.com/litv/pdf/mpds046e; Mounting Technology: Surface Mount; PartNumber: TPA301DGNG4; ComponentLink2Description: Datasheet; ComponentLink2URL: http://www.ti.com/general/docs/lit/getliterature.tsp?genericPartNumber=TPA301&fileType=pdf; PackageVersion: 4073271/F, 05/2011; PackageDescription: 8-Pin Plastic Small Outline, Body 3 x 3 mm, Pitch 0.65 mm; Speaker Amp Type: Class-AB; ComponentLink3Description: Package Specification; ComponentLink1Description: Manufacturer URL; ComponentLink1URL: http://www.ti.com/; Speaker Channels: Mono; DatasheetVersion: SLOS208E; Code_JEDEC: MO-187; MountType: SMT; Supplier 1: Digi-Key; Supplier Part Number 1: 296-1946-5-ND
U5 = TLV2760IDBVTG4: Single MicroPower, Rail-to-Rail, Single Supply Amplifier with Shutdown, 1.8 to 3.6 V, -40 to 85 degC, 6-pin SOT23 (DBV0006A), Green (RoHS & no Sb/Br); Manufacturer: Texas Instruments; Alternate Manufacturer: None; Alternate PartNumber: Equivalent; CMRR(Min)(dB): 50; GBW(Typ)(MHz): 0.5; IIB(Max)(pA): 15; Iq per channel(Max)(mA): 0.028; Number of Channels: 1; Offset Drift(Typ)(uV/C): 9; Packing: SMALL T&R; Rating: Catalog; Slew Rate(Typ)(V/us): 0.2; Sub Family: Low Power Amp (<=500uA), Low Supply Voltage Amplifier (<=2.7V), Precision Amplifier; Total Supply Voltage(Max)(+5V is 5, +/-5V is 10): 3.6; Total Supply Voltage(Min)(+5V is 5, +/-5V is 10): 1.8; Vio (25C)(Max)(mV): 3.5; DatasheetVersion: SLOS326E; PackageVersion: 4073253-5/K, 03/2006; PackageReference: DBV0006A; PackageDescription: 6-Pin Plastic Small Outline, Body 1.6 x 2.9 mm, Pitch 0.95 mm; Eco-Plan: Green (RoHS & no Sb/Br); MountType: SMT; Code_JEDEC: MO-178; ComponentLink1Description: Manufacturer URL; ComponentLink1URL: http://www.ti.com/; ComponentLink2Description: Datasheet; ComponentLink2URL: http://www.ti.com/lit/ds/symlink/tlv2760.pdf; ComponentLink3Description: Package Specification; ComponentLink3URL: http://www.ti.com/litv/pdf/mpds026h; PartNumber: TLV2760IDBVTG4; Supplier 1: Digi-Key; Supplier Part Number 1: 296-10659-1-ND